# EAGLE design ServoBoard (EAGLE 5.11)
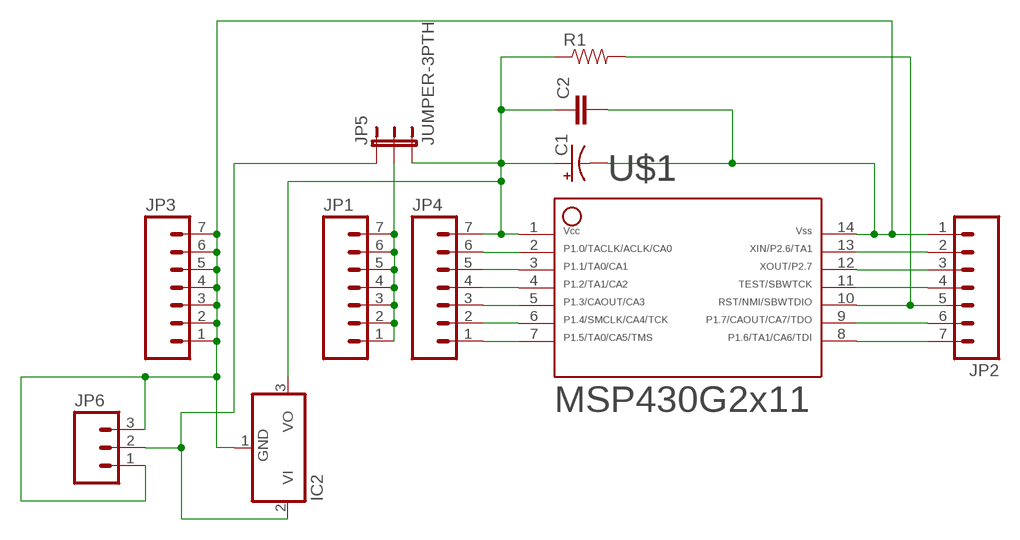
[diagram p0: schematic, sheet 1]

## Parts
C1  CAP_POLPTH1  [CPOL-RADIAL-100UF-25V]
C2  CAPPTH2  [CAP-PTH-SMALL2]
IC2  7908L  [TO92]
JP1  M07  [1X07]
JP2  M07  [1X07]
JP3  M07  [1X07]
JP4  M07  [1X07]
JP5  JUMPER-3PTH  [1X03]
JP6  M03LONGPADS  [1X03_LONGPADS]
R1  RESISTOR1206  [1206]
U$1  G2X11--N14  [N14]

## Nets
N$1: JP1.1 JP1.2 JP1.3 JP1.4 JP1.5 JP1.6 JP1.7 JP5.2
N$2: JP4.6 U$1.2
N$3: JP4.5 U$1.3
N$4: JP4.4 U$1.4
N$5: JP4.3 U$1.5
N$6: JP4.2 U$1.6
N$7: JP4.1 U$1.7
N$8: C1.2(-) C2.2 IC2.1(GND) JP2.1 JP3.1 JP3.2 JP3.3 JP3.4 JP3.5 JP3.6 JP3.7 JP6.1 JP6.3 U$1.14
N$9: JP2.2 U$1.13
N$10: JP2.3 U$1.12
N$11: JP2.4 U$1.11
N$12: JP2.5 R1.2 U$1.10
N$13: JP2.6 U$1.9
N$14: JP2.7 U$1.8
N$15: C1.1(+) C2.1 IC2.3(VO) JP4.7 JP5.3 R1.1 U$1.1
N$16: IC2.2(VI) JP5.1 JP6.2

## Library data of the parts
C1 = SparkFun:CAP_POL: Capacitor Polarized These are standard SMD and PTH capacitors. Normally 10uF, 47uF, and 100uF in electrolytic and tantalum varieties. Always verify the external diameter of the through hole cap, it varies with capacity, voltage, and manufacturer. The EIA devices should be standard.
C2 = SparkFun:CAP: Capacitor Standard 0603 ceramic capacitor, and 0.1" leaded capacitor.
IC2 = linear:79*: Negative VOLTAGE REGULATOR
JP1-JP4 = SparkFun:M07: Header 7 Standard 7-pin 0.1" header. Use with straight break away headers (SKU : PRT-00116), right angle break away headers (PRT-00553), swiss pins (PRT-00743), machine pins (PRT-00117), and female headers (PRT-00115). NOTES ON THE VARIANTS LOCK and LOCK_LONGPADS... This footprint was designed to help hold the alignment of a through-hole component (i.e. 7-pin header) while soldering it into place. You may notice that each hole has been shifted either up or down by 0.005 of an inch from it's more standard position (which is usually a perfectly straight line). This slight alteration caused the pins (the squares in the middle) to touch the edges of the holes. Because they are alternating, it causes a "brace" to hold the header in place. 0.005 has proven to be the perfect amount of "off-center" position when using our standard breakaway headers. Although looks a little odd when you look at the bare footprint, once you have a header in there, the alteration is very hard to notice. Also, if you push a header all the way into place, it is covered up entirely on the bottom side. This idea of altering the position of holes to aid alignment will be further integrated into the Sparkfun Library for other footprints. It can help hold any component with 3 or more connection pins.
JP5 = SparkFun:JUMPER-3
JP6 = SparkFun:M03: Header 3 Standard 3-pin 0.1" header. Use with straight break away headers (SKU : PRT-00116), right angle break away headers (PRT-00553), swiss pins (PRT-00743), machine pins (PRT-00117), and female headers (PRT-00115). Molex polarized connector foot print use with SKU : PRT-08232 with associated crimp pins and housings.
R1 = SparkFun:RESISTOR: Resistor Basic schematic elements and footprints for 0603, 1206, and PTH resistors.
U$1 = TI_MSP430G_v1:G2X11--N14: ***MSP430G2X11***N14

## Board
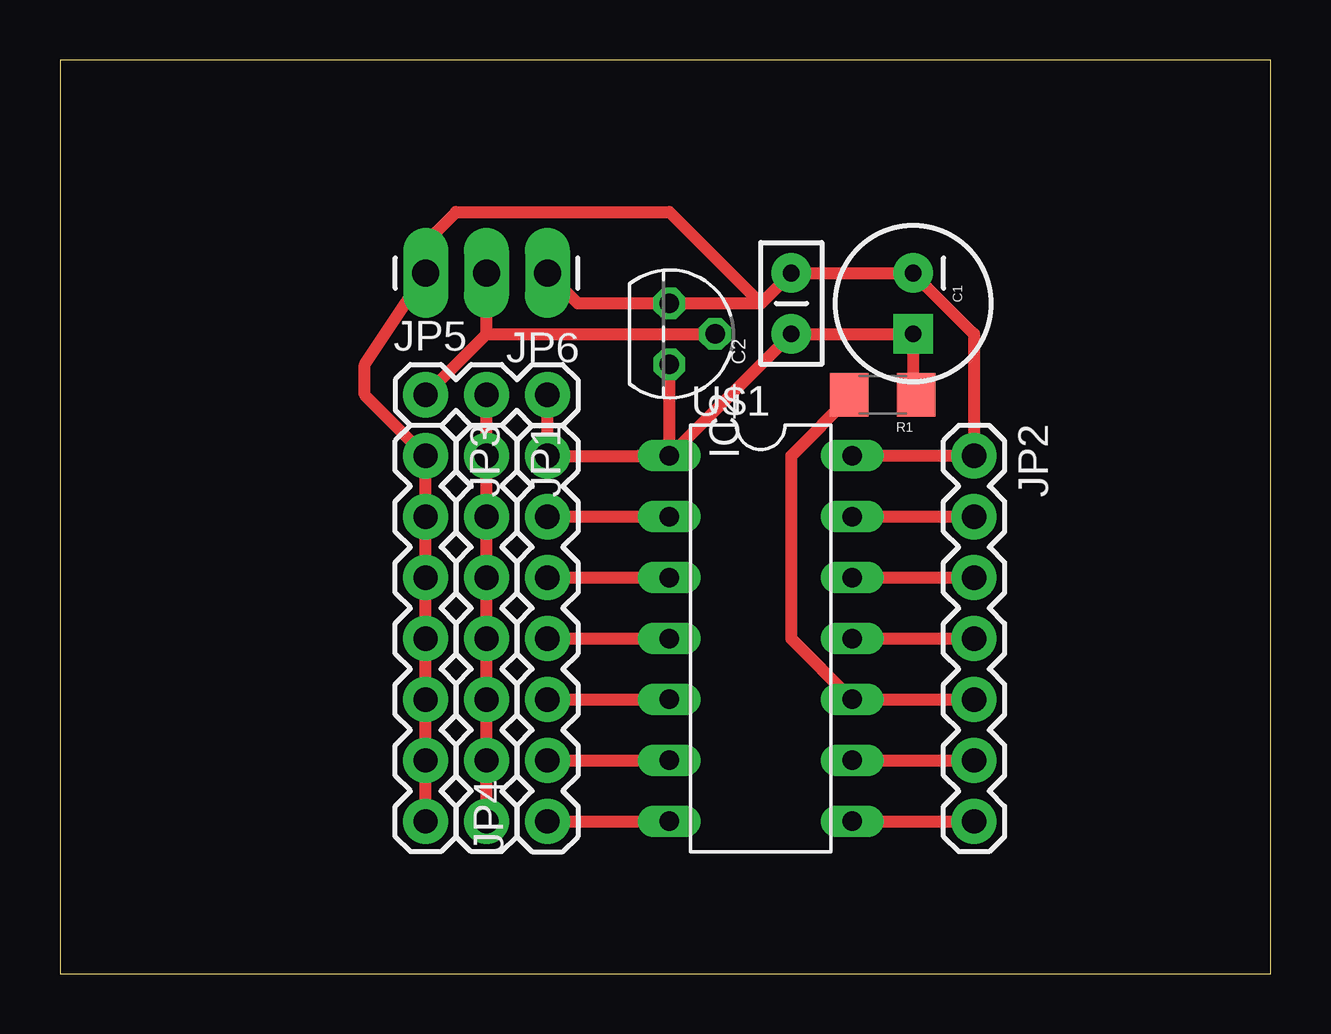
[diagram p1: board, top side]

Size 50.47 x 38.09 mm. Coordinates in mm from the lower left corner, seen from the top.
Outline: 0,0 50.47,0 50.47,38.09 0,38.09 0,0
Copper layers (1*16): Top 0.035mm / dielectric 1.5mm / Bottom 0.035mm
Design rules "default *": minimum track width 20mil, minimum drill 24mil, track to track 10mil, track to pad 10mil, pad to pad 8mil, via to via 8mil, smd to smd 8mil, copper to edge 40mil, drill to drill 8mil, minimum pad ring 10mil, minimum via ring 8mil, stop-mask expansion 4mil, vias tented up to drill 0mil, thermal gap 10mil

### Footprints (pad centres in the part's own frame; a part is rotated, then mirrored left to right if it is on the bottom)
CPOL-RADIAL-100UF-25V = drill 0.7 pad 1.651 square: 1 1.27,0 | drill 0.7 pad 1.651 round: 2 -1.27,0
CAP-PTH-SMALL2 = drill 0.7 pad 1.651 round: 1 0,0; 2 2.54,0
TO92 = drill 0.813 octagon: 1 -1.27,0; 2 0,1.905; 3 1.27,0
1X07 = drill 1.016 pad 1.88 round: 1 0,0; 2 2.54,0; 3 5.08,0; 4 7.62,0; 5 10.16,0; 6 12.7,0; 7 15.24,0
1X03 = drill 1.016 pad 1.88 round: 1 0,0; 2 2.54,0; 3 5.08,0
1X03_LONGPADS = drill 1.118 pad 1.88 long: 1 0,0; 2 2.54,0; 3 5.08,0
1206 = smd 1.6 x 1.8: 1 -1.4,0; 2 1.4,0
N14 = drill 0.813 long: 1 -7.625,-3.81; 2 -5.085,-3.81; 3 -2.545,-3.81; 4 -0.005,-3.81; 5 2.535,-3.81; 6 5.075,-3.81; 7 7.615,-3.81; 8 7.615,3.81; 9 5.075,3.81; 10 2.535,3.81; 11 -0.005,3.81; 12 -2.545,3.81; 13 -5.085,3.81; 14 -7.625,3.81

### Placement (x,y rotation side)
C1  35.56,27.94 270 top
C2  30.48,26.67 90 top
IC2  25.4,26.67 270 top
JP1  17.78,21.59 270 top
JP2  38.1,21.59 270 top
JP3  15.24,21.59 270 top
JP4  20.32,6.35 90 top
JP5  15.24,24.13 0 top
JP6  20.32,29.21 180 top
R1  34.29,24.13 180 top
U$1  29.21,13.97 270 top

### Tracks (layer width: path | path; a pad name or v marks a point on that pad's centre or on a via)
N$1
  Top 0.508: JP1.7 JP1.6 JP1.5 JP1.4 JP1.3 JP1.2 JP1.1 JP5.2
N$2
  Top 0.508: JP4.6 U$1.2
N$3
  Top 0.508: JP4.5 U$1.3
N$4
  Top 0.508: JP4.4 U$1.4
N$5
  Top 0.508: JP4.3 U$1.5
N$6
  Top 0.508: JP4.2 U$1.6
N$7
  Top 0.508: JP4.1 U$1.7
N$8
  Top 0.508: JP3.7 JP3.6 JP3.5 JP3.4 JP3.3 JP3.2 JP3.1 12.7,24.13 12.7,25.4 JP6.3 15.24,30.48 16.51,31.75 25.4,31.75 29.21,27.94 | U$1.14 JP2.1 38.1,26.67 C1.2 C2.2 29.21,27.94 | JP6.1 21.59,27.94 IC2.1 29.21,27.94
N$9
  Top 0.508: JP2.2 U$1.13
N$10
  Top 0.508: JP2.3 U$1.12
N$11
  Top 0.508: JP2.4 U$1.11
N$12
  Top 0.508: U$1.10 JP2.5 | U$1.10 30.48,13.97 30.48,21.59 33.02,24.13 R1.2 | U$1.10
N$13
  Top 0.508: JP2.6 U$1.9
N$14
  Top 0.508: JP2.7 U$1.8
N$15
  Top 0.508: 24.13,21.59 JP4.7 JP5.3 | 24.13,21.59 U$1.1 | 24.13,21.59 U$1.1 | U$1.1 IC2.3 | R1.1 35.56,24.13 C1.1 C2.1 U$1.1 | U$1.1
N$16
  Top 0.508: JP5.1 17.78,26.67 | 17.78,26.67 IC2.2 | 17.78,26.67 JP6.2